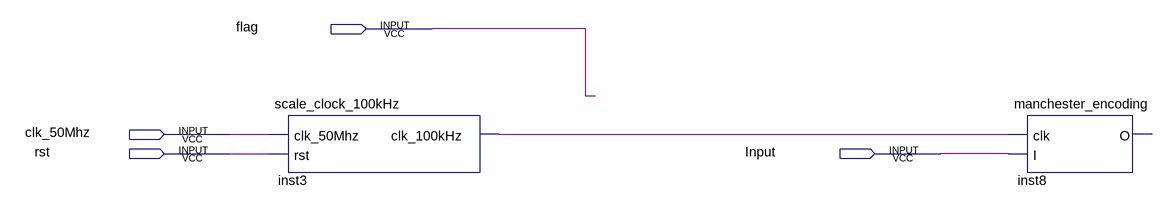
[diagram p0: schematic sheet]
// Quartus schematic manchesterPayload.bdf as structural Verilog: 2 symbols, 4 pins
module manchesterPayload (
  input  flag,
  input  clk_50Mhz,
  input  rst,
  input  Input
);

  wire inst3_clk_100khz;

  scale_clock_100kHz inst3 (.clk_50Mhz(clk_50Mhz), .rst(rst), .clk_100kHz(inst3_clk_100khz));
  manchester_encoding inst8 (.clk(inst3_clk_100khz), .I(Input));  // open: O
endmodule
